# EAGLE design UI_Controller_Damping_R (EAGLE 7.2.0)
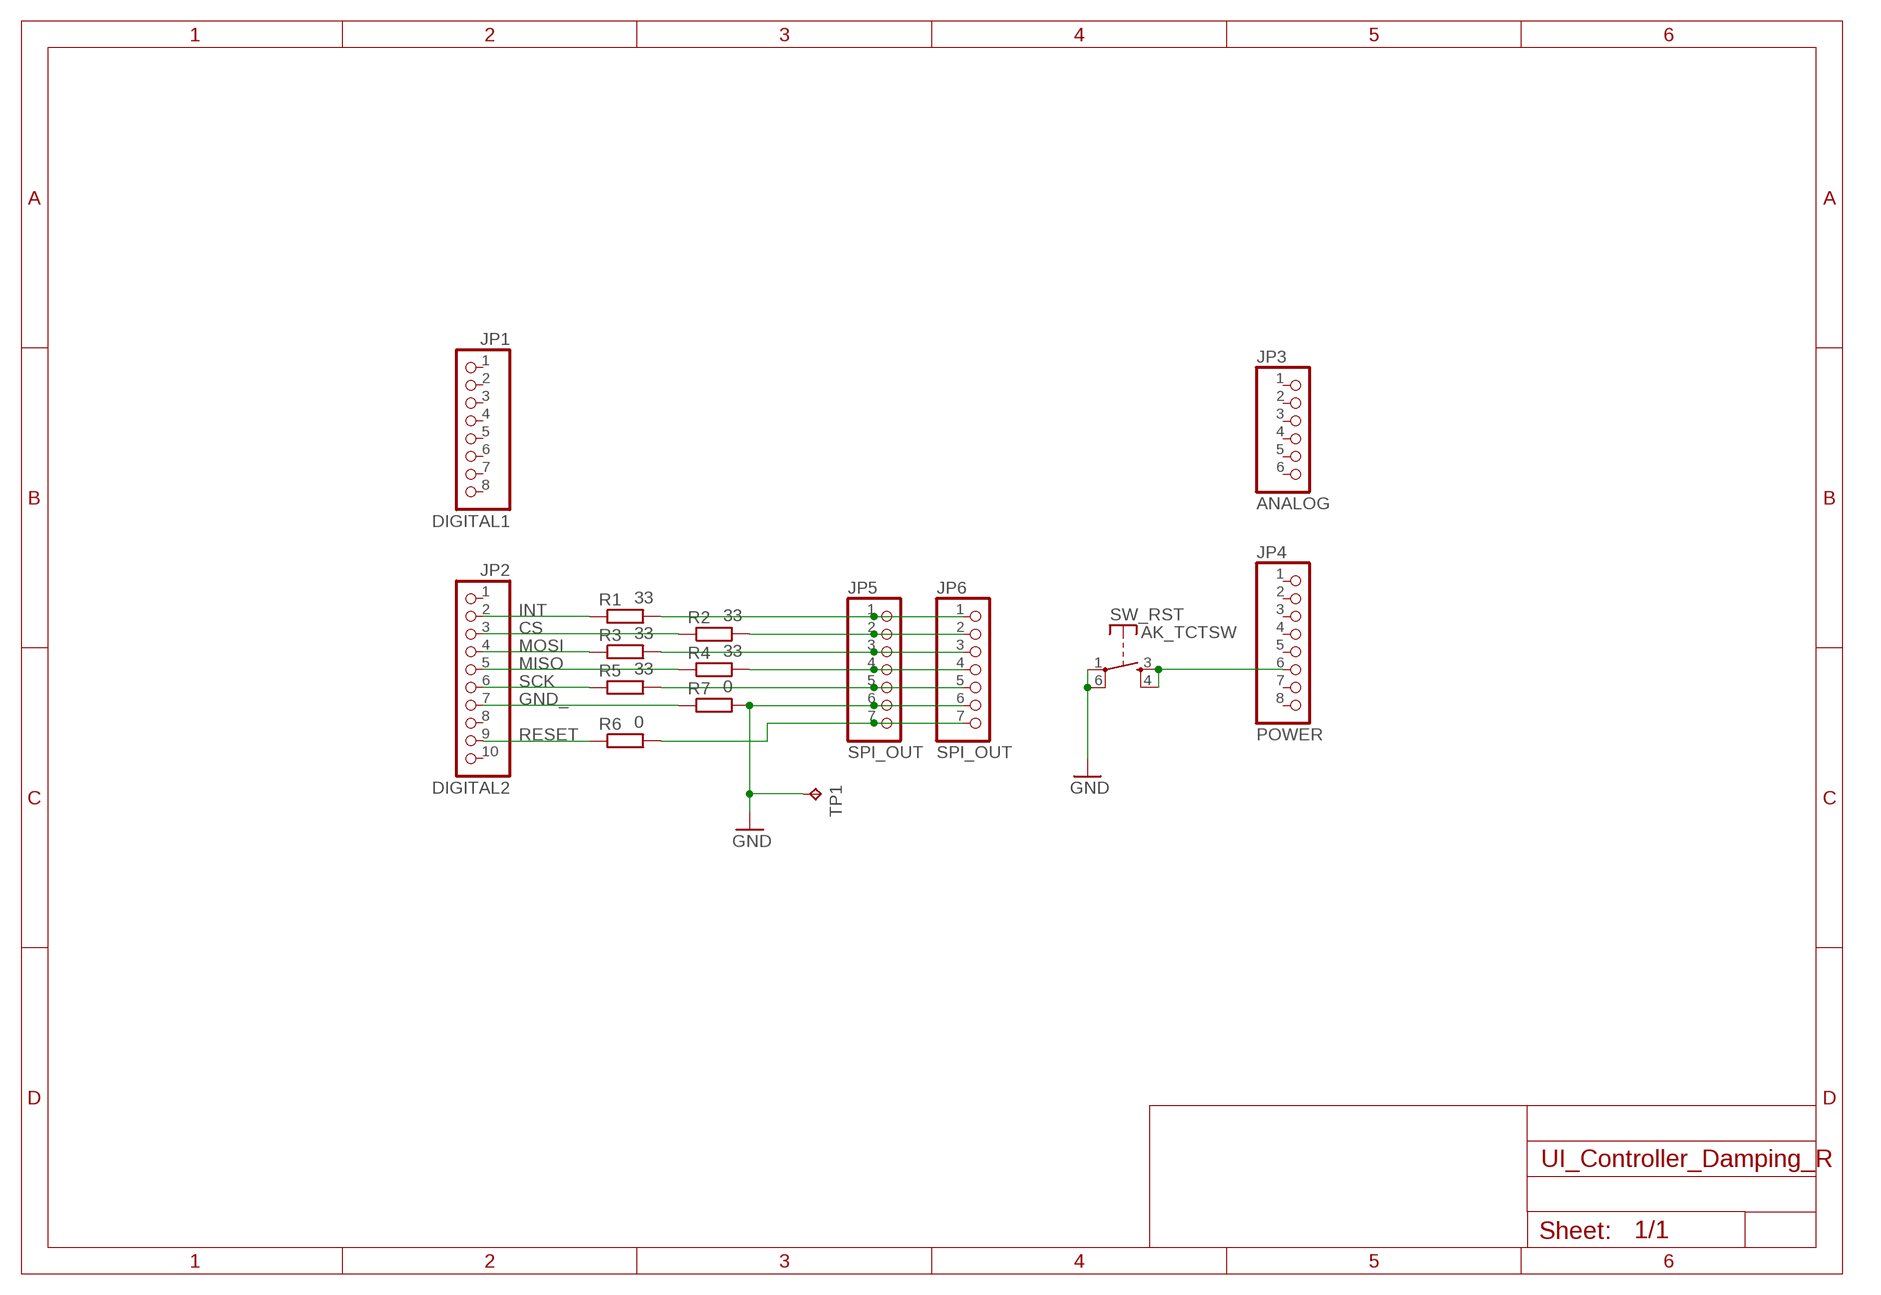
[diagram p0: schematic, sheet 1]

## Parts
JP1  DIGITAL1  PINHD-1X8  [1X08]
JP2  DIGITAL2  PINHD-1X10  [1X10]
JP3  ANALOG  PINHD-1X6  [1X06]
JP4  POWER  PINHD-1X8  [1X08]
JP5  SPI_OUT  PINHD-1X7  [1X07]
JP6  SPI_OUT  PINHD-1X7  [1X07]
R1  33  R-EU_0207/7  [0207/7]
R2  33  R-EU_0207/7  [0207/7]
R3  33  R-EU_0207/7  [0207/7]
R4  33  R-EU_0207/7  [0207/7]
R5  33  R-EU_0207/7  [0207/7]
R6  0  R-EU_0207/7  [0207/7]
R7  0  R-EU_0207/7  [0207/7]
SW_RST  AK_TCTSW  [TME1]
TP1  TPPAD1-13  [P1-13]

## Nets
CS: JP2.3 R2.1
GND: JP5.6 JP6.6 R7.2 SW_RST.1(P) SW_RST.6(P) TP1.TP
GND_: JP2.7 R7.1
INT: JP2.2 R1.1
MISO: JP2.5 R4.1
MOSI: JP2.4 R3.1
N$1: JP5.1 JP6.1 R1.2
N$2: JP5.2 JP6.2 R2.2
N$3: JP5.3 JP6.3 R3.2
N$4: JP5.4 JP6.4 R4.2
N$5: JP5.5 JP6.5 R5.2
N$6: JP5.7 JP6.7 R6.2
N$7: JP4.6 SW_RST.3(S) SW_RST.4(S)
RESET: JP2.9 R6.1
SCK: JP2.6 R5.1
Unconnected: JP1.1 JP1.2 JP1.3 JP1.4 JP1.5 JP1.6 JP1.7 JP1.8 JP2.1 JP2.8 JP2.10 JP3.1 JP3.2 JP3.3 JP3.4 JP3.5 JP3.6 JP4.1 JP4.2 JP4.3 JP4.4 JP4.5 JP4.7 JP4.8

## Library data of the parts
JP1 JP4 = pinhead:PINHD-1X8: PIN HEADER
JP2 = pinhead:PINHD-1X10: PIN HEADER
JP3 = pinhead:PINHD-1X6: PIN HEADER
JP5 JP6 = pinhead:PINHD-1X7: PIN HEADER
R1-R7 = rcl:R-EU_: RESISTOR, European symbol
SW_RST = mylib2:AK_TCTSW
TP1 = testpad:TP: Test pad

## Board
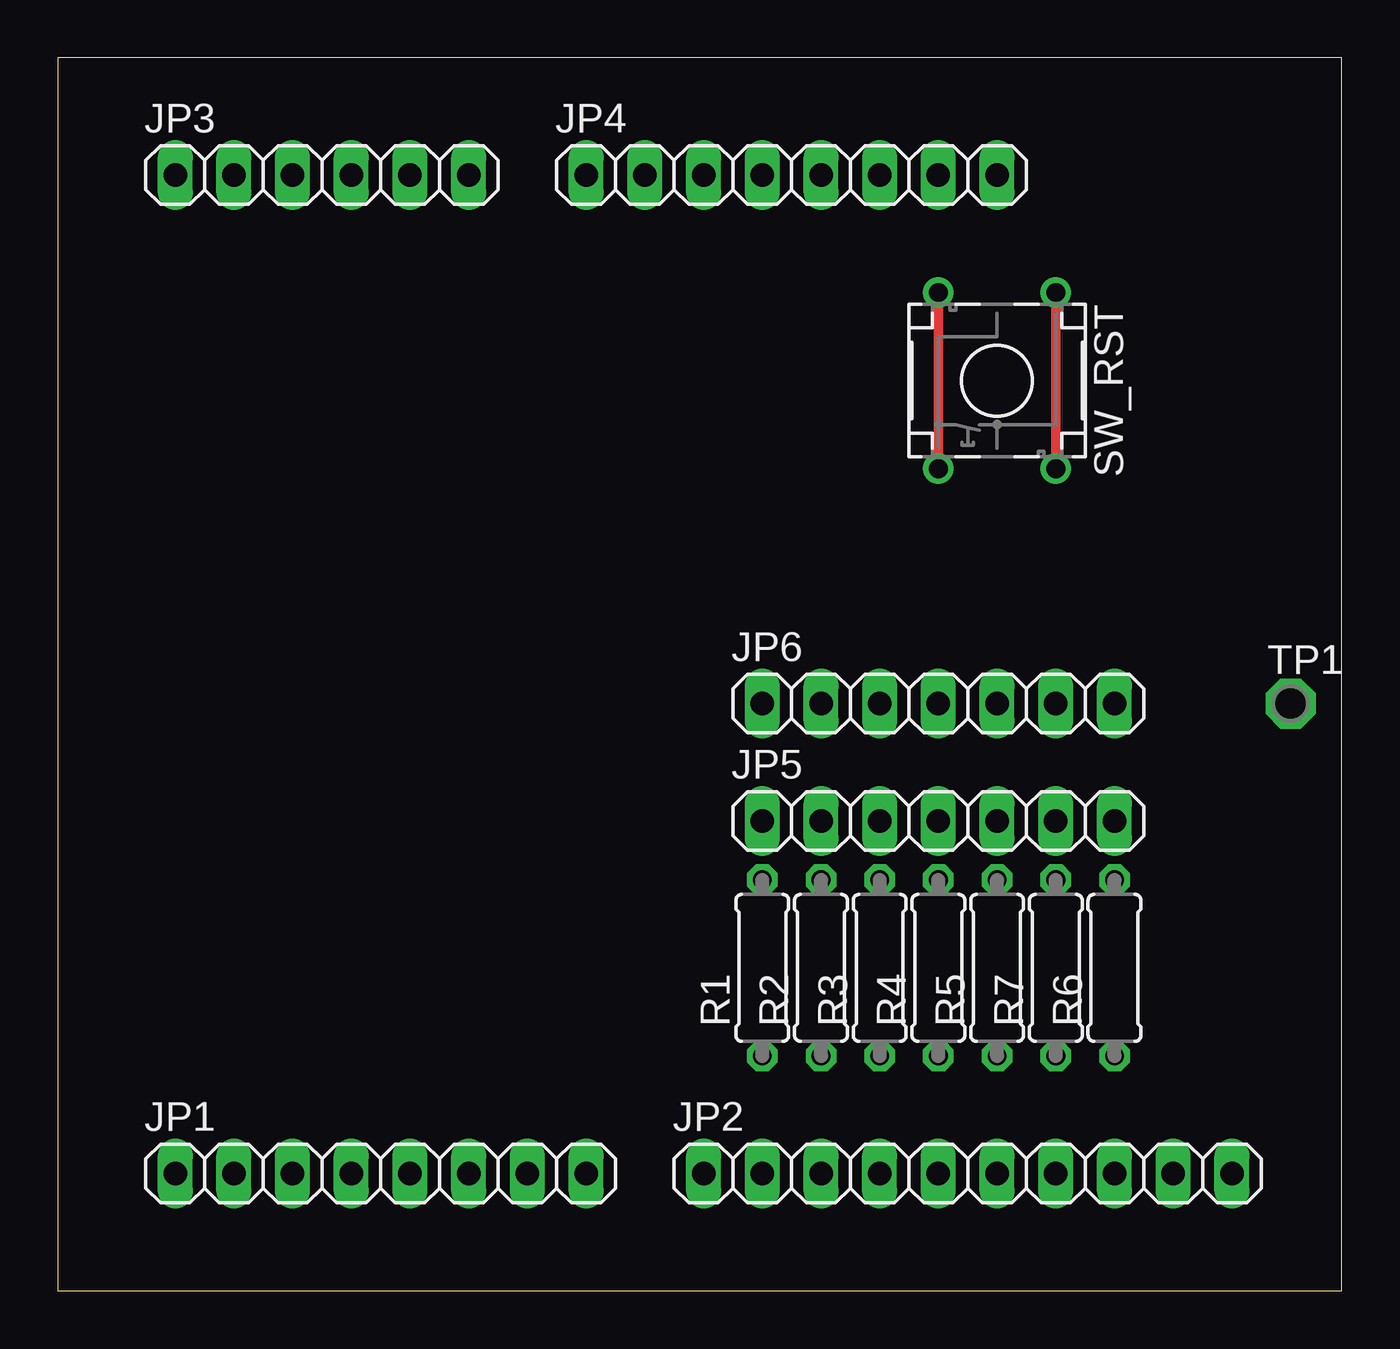
[diagram p1: board, top side]
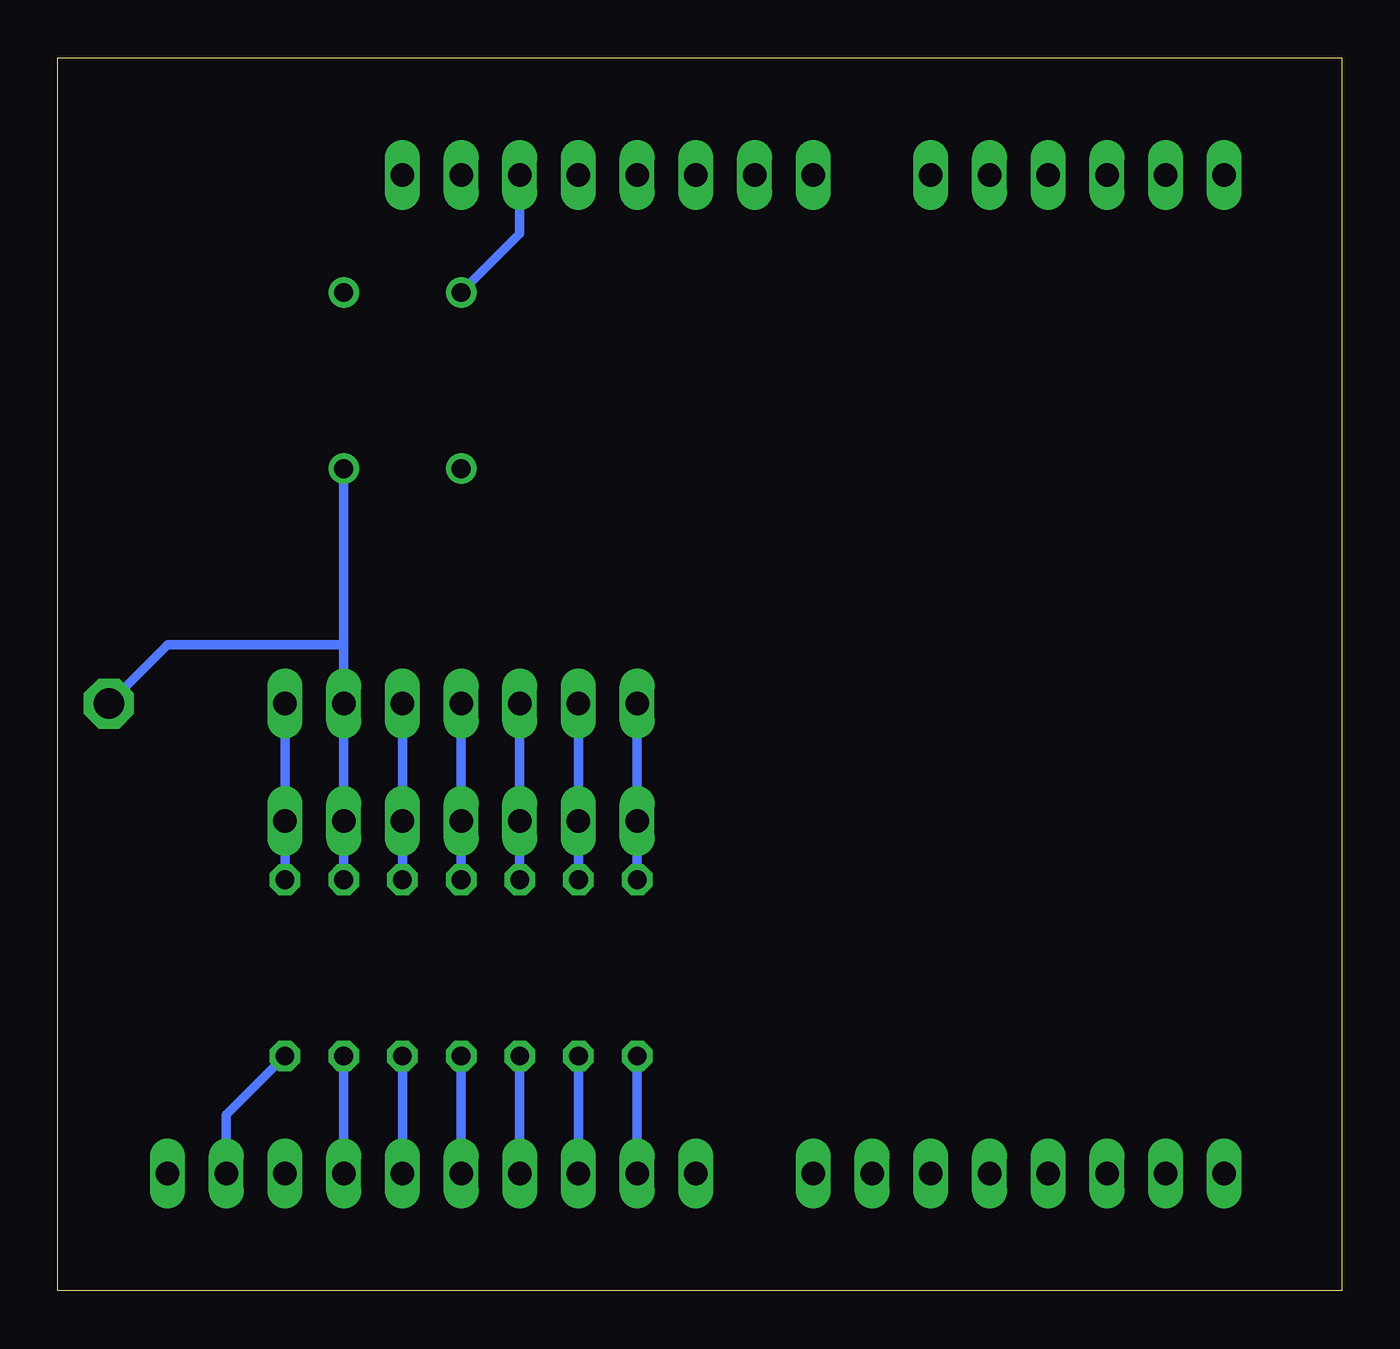
[diagram p2: board, bottom side, seen from below]

Size 55.55 x 53.33 mm. Coordinates in mm from the lower left corner, seen from the top.
Outline: 0,0 55.55,0 55.55,53.33 0,53.33 0,0
Copper layers (1*16): Top 0.035mm / dielectric 1.5mm / Bottom 0.035mm
Design rules "default": minimum track width 10mil, minimum drill 24mil, track to track 8mil, track to pad 8mil, pad to pad 8mil, via to via 8mil, smd to smd 8mil, copper to edge 40mil, drill to drill 8mil, minimum pad ring 10mil, minimum via ring 8mil, stop-mask expansion 4mil, vias tented up to drill 0mil, thermal gap 10mil

### Footprints (pad centres in the part's own frame; a part is rotated, then mirrored left to right if it is on the bottom)
1X08 = drill 1.016 long: 1 -8.89,0; 2 -6.35,0; 3 -3.81,0; 4 -1.27,0; 5 1.27,0; 6 3.81,0; 7 6.35,0; 8 8.89,0
1X10 = drill 1.016 long: 1 -11.43,0; 2 -8.89,0; 3 -6.35,0; 4 -3.81,0; 5 -1.27,0; 6 1.27,0; 7 3.81,0; 8 6.35,0; 9 8.89,0; 10 11.43,0
1X06 = drill 1.016 long: 1 -6.35,0; 2 -3.81,0; 3 -1.27,0; 4 1.27,0; 5 3.81,0; 6 6.35,0
1X07 = drill 1.016 long: 1 -7.62,0; 2 -5.08,0; 3 -2.54,0; 4 0,0; 5 2.54,0; 6 5.08,0; 7 7.62,0
0207/7 = drill 0.813 octagon: 1 -3.81,0; 2 3.81,0
TME1 = drill 0.813: 1 -2.54,-3.81; 3 2.54,-3.81; 4 2.54,3.81; 6 -2.54,3.81
P1-13 = drill 1.321 pad 2.159 octagon: TP 0,0

### Placement (x,y rotation side)
JP1  13.97,5.08 0 top
JP2  39.37,5.08 0 top
JP3  11.43,48.26 0 top
JP4  31.75,48.26 0 top
JP5  38.1,20.32 0 top
JP6  38.1,25.4 0 top
R1  30.48,13.97 90 top
R2  33.02,13.97 90 top
R3  35.56,13.97 90 top
R4  38.1,13.97 90 top
R5  40.64,13.97 90 top
R6  45.72,13.97 90 top
R7  43.18,13.97 90 top
SW_RST  40.64,39.37 180 top
TP1  53.34,25.4 0 top

### Tracks (layer width: path | path; a pad name or v marks a point on that pad's centre or on a via)
CS
  Bottom 0.406: R2.1 JP2.3
GND
  Top 0.406: SW_RST.1 SW_RST.6
  Bottom 0.406: R7.2 JP5.6 JP6.6 43.18,27.94 | SW_RST.6 43.18,27.94 | TP1.TP 50.8,27.94 43.18,27.94
GND_
  Bottom 0.406: R7.1 JP2.7
INT
  Bottom 0.406: R1.1 JP2.2
MISO
  Bottom 0.406: R4.1 JP2.5
MOSI
  Bottom 0.406: R3.1 JP2.4
N$1
  Bottom 0.406: JP6.1 JP5.1 R1.2
N$2
  Bottom 0.406: JP6.2 JP5.2 R2.2
N$3
  Bottom 0.406: JP6.3 JP5.3 R3.2
N$4
  Bottom 0.406: JP6.4 JP5.4 R4.2
N$5
  Bottom 0.406: JP6.5 JP5.5 R5.2
N$6
  Bottom 0.406: R6.2 JP5.7 JP6.7
N$7
  Top 0.406: SW_RST.3 SW_RST.4
  Bottom 0.406: JP4.6 35.56,45.72 SW_RST.3
RESET
  Bottom 0.406: R6.1 48.26,7.62 JP2.9
SCK
  Bottom 0.406: R5.1 JP2.6